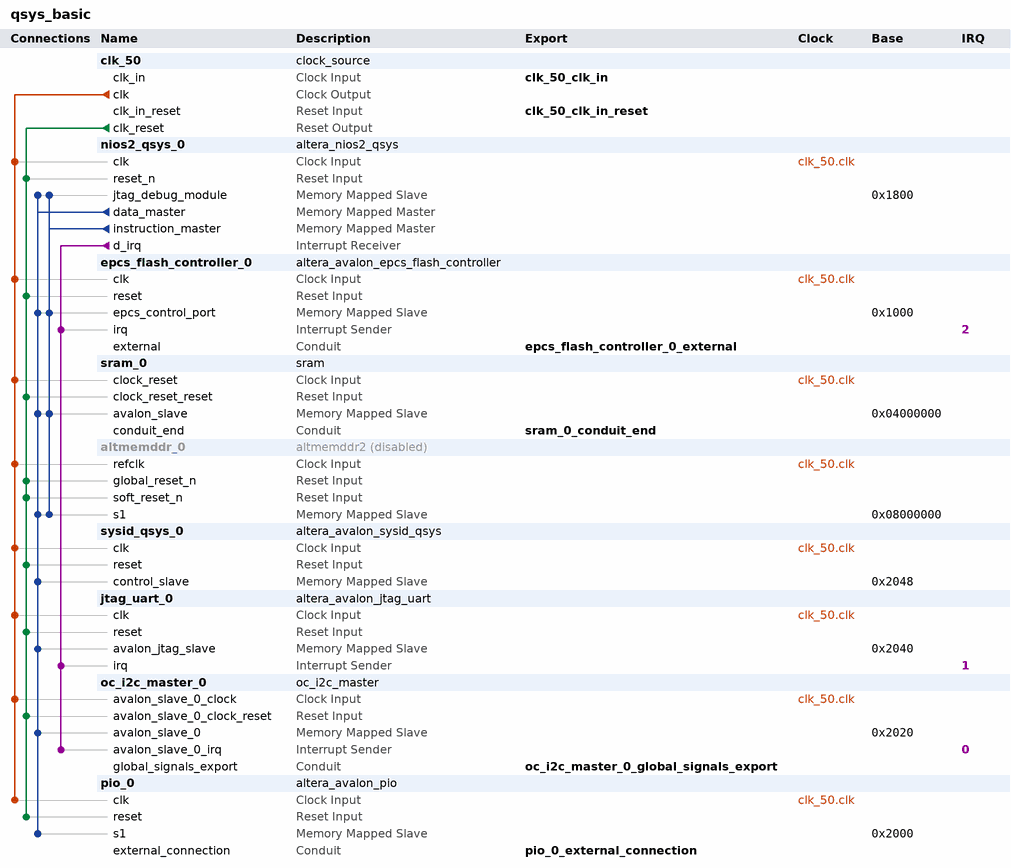
[diagram p0: system contents]
# Platform Designer (Qsys) system qsys_basic, Cyclone IV E EP4CE22F17C8
# Parameters at their usual value, and those the tool derives, are not listed.
package require -exact qsys 13.0
create_system qsys_basic
set_project_property DEVICE_FAMILY {Cyclone IV E}
set_project_property DEVICE EP4CE22F17C8

add_instance clk_50 clock_source 13.0
set_instance_parameter_value clk_50 clockFrequency 50000000

add_instance nios2_qsys_0 altera_nios2_qsys 13.0
set_instance_parameter_value nios2_qsys_0 resetSlave epcs_flash_controller_0.epcs_control_port
set_instance_parameter_value nios2_qsys_0 exceptionSlave sram_0.avalon_slave
set_instance_parameter_value nios2_qsys_0 breakSlave nios2_qsys_0.jtag_debug_module
set_instance_parameter_value nios2_qsys_0 impl Tiny
set_instance_parameter_value nios2_qsys_0 icache_size 512

add_instance epcs_flash_controller_0 altera_avalon_epcs_flash_controller 13.0.1

add_instance sram_0 sram 1.0
set_instance_parameter_value sram_0 DATA_BITS 16
set_instance_parameter_value sram_0 ADDR_BITS 18

add_instance altmemddr_0 altmemddr2 13.0
set_instance_property altmemddr_0 ENABLED false
set_instance_parameter_value altmemddr_0 pipeline_commands false
set_instance_parameter_value altmemddr_0 debug_en false
set_instance_parameter_value altmemddr_0 export_debug_port false
set_instance_parameter_value altmemddr_0 use_generated_memory_model true
set_instance_parameter_value altmemddr_0 dedicated_memory_clk_phase_label {Dedicated memory clock phase:}
set_instance_parameter_value altmemddr_0 mem_if_clk_mhz 150.0
set_instance_parameter_value altmemddr_0 quartus_project_exists false
set_instance_parameter_value altmemddr_0 local_if_drate Half
set_instance_parameter_value altmemddr_0 enable_v72_rsu false
set_instance_parameter_value altmemddr_0 local_if_clk_mhz_label 75.0
set_instance_parameter_value altmemddr_0 new_variant true
set_instance_parameter_value altmemddr_0 mem_if_memtype {DDR2 SDRAM}
set_instance_parameter_value altmemddr_0 pll_ref_clk_mhz 50.0
set_instance_parameter_value altmemddr_0 mem_if_clk_ps_label {(6667 ps)}
set_instance_parameter_value altmemddr_0 family {Cyclone IV E}
set_instance_parameter_value altmemddr_0 project_family {Cyclone IV E}
set_instance_parameter_value altmemddr_0 speed_grade 8
set_instance_parameter_value altmemddr_0 dedicated_memory_clk_phase 0
set_instance_parameter_value altmemddr_0 pll_ref_clk_ps_label {(20000 ps)}
set_instance_parameter_value altmemddr_0 avalon_burst_length 1
set_instance_parameter_value altmemddr_0 mem_if_clk_pair_count 1
set_instance_parameter_value altmemddr_0 mem_if_cs_per_dimm 1
set_instance_parameter_value altmemddr_0 pre_latency_label {Fix read latency at:}
set_instance_parameter_value altmemddr_0 dedicated_memory_clk_en false
set_instance_parameter_value altmemddr_0 mirror_addressing 0
set_instance_parameter_value altmemddr_0 mem_if_bankaddr_width 2
set_instance_parameter_value altmemddr_0 register_control_word_9 0000
set_instance_parameter_value altmemddr_0 mem_if_rowaddr_width 13
set_instance_parameter_value altmemddr_0 mem_dyn_deskew_en false
set_instance_parameter_value altmemddr_0 post_latency_label {cycles (0 cycles=minimum latency, non-deterministic)}
set_instance_parameter_value altmemddr_0 mem_if_dm_pins_en Yes
set_instance_parameter_value altmemddr_0 local_if_dwidth_label 64
set_instance_parameter_value altmemddr_0 register_control_word_7 0000
set_instance_parameter_value altmemddr_0 register_control_word_8 0000
set_instance_parameter_value altmemddr_0 mem_if_preset {Custom (Micron MT47H16M16BG-37E)}
set_instance_parameter_value altmemddr_0 mem_if_pchaddr_bit 10
set_instance_parameter_value altmemddr_0 WIDTH_RATIO 4
set_instance_parameter_value altmemddr_0 vendor Micron
set_instance_parameter_value altmemddr_0 register_control_word_3 0000
set_instance_parameter_value altmemddr_0 register_control_word_4 0000
set_instance_parameter_value altmemddr_0 chip_or_dimm {Discrete Device}
set_instance_parameter_value altmemddr_0 register_control_word_5 0000
set_instance_parameter_value altmemddr_0 register_control_word_6 0000
set_instance_parameter_value altmemddr_0 mem_fmax 267.0
set_instance_parameter_value altmemddr_0 register_control_word_0 0000
set_instance_parameter_value altmemddr_0 register_control_word_size 4
set_instance_parameter_value altmemddr_0 register_control_word_1 0000
set_instance_parameter_value altmemddr_0 register_control_word_2 0000
set_instance_parameter_value altmemddr_0 register_control_word_11 0000
set_instance_parameter_value altmemddr_0 register_control_word_10 0000
set_instance_parameter_value altmemddr_0 mem_if_cs_width 1
set_instance_parameter_value altmemddr_0 mem_if_preset_rlat 0
set_instance_parameter_value altmemddr_0 mem_if_cs_per_rank 1
set_instance_parameter_value altmemddr_0 fast_simulation_en FAST
set_instance_parameter_value altmemddr_0 register_control_word_15 0000
set_instance_parameter_value altmemddr_0 register_control_word_14 0000
set_instance_parameter_value altmemddr_0 mem_if_dwidth 16
set_instance_parameter_value altmemddr_0 mem_if_dq_per_dqs 8
set_instance_parameter_value altmemddr_0 mem_if_coladdr_width 10
set_instance_parameter_value altmemddr_0 register_control_word_13 0000
set_instance_parameter_value altmemddr_0 register_control_word_12 0000
set_instance_parameter_value altmemddr_0 mem_tiha_ps 500
set_instance_parameter_value altmemddr_0 mem_tdsh_ck 0.2
set_instance_parameter_value altmemddr_0 mem_if_trfc_ns 75.0
set_instance_parameter_value altmemddr_0 mem_tqh_ck 0.36
set_instance_parameter_value altmemddr_0 mem_tisa_ps 500
set_instance_parameter_value altmemddr_0 mem_tdss_ck 0.2
set_instance_parameter_value altmemddr_0 mem_trtp_ns 7.5
set_instance_parameter_value altmemddr_0 mem_if_tinit_us 200.0
set_instance_parameter_value altmemddr_0 mem_if_trcd_ns 15.0
set_instance_parameter_value altmemddr_0 mem_if_twtr_ck 2
set_instance_parameter_value altmemddr_0 mem_trrd_ns 10.0
set_instance_parameter_value altmemddr_0 mem_tdqss_ck 0.25
set_instance_parameter_value altmemddr_0 mem_tqhs_ps 400
set_instance_parameter_value altmemddr_0 mem_tdsa_ps 345
set_instance_parameter_value altmemddr_0 mem_tac_ps 500
set_instance_parameter_value altmemddr_0 mem_tdha_ps 285
set_instance_parameter_value altmemddr_0 mem_if_tras_ns 40.0
set_instance_parameter_value altmemddr_0 mem_if_twr_ns 15.0
set_instance_parameter_value altmemddr_0 mem_tdqsck_ps 450
set_instance_parameter_value altmemddr_0 mem_if_trp_ns 15.0
set_instance_parameter_value altmemddr_0 mem_tdqsq_ps 300
set_instance_parameter_value altmemddr_0 mem_if_tmrd_ns 7.5
set_instance_parameter_value altmemddr_0 mem_tfaw_ns 50.0
set_instance_parameter_value altmemddr_0 mem_if_trefi_us 7.8
set_instance_parameter_value altmemddr_0 mem_tcl_40_fmax 267.0
set_instance_parameter_value altmemddr_0 mem_odt Disabled
set_instance_parameter_value altmemddr_0 mp_WLH_percent 0.6
set_instance_parameter_value altmemddr_0 mem_drv_str Normal
set_instance_parameter_value altmemddr_0 mp_DH_percent 0.5
set_instance_parameter_value altmemddr_0 input_period 0
set_instance_parameter_value altmemddr_0 mp_QH_percent 0.5
set_instance_parameter_value altmemddr_0 mp_QHS_percent 0.5
set_instance_parameter_value altmemddr_0 mem_tcl_30_fmax 200.0
set_instance_parameter_value altmemddr_0 ac_clk_select 90
set_instance_parameter_value altmemddr_0 mp_DQSQ_percent 0.65
set_instance_parameter_value altmemddr_0 mp_DS_percent 0.6
set_instance_parameter_value altmemddr_0 pll_reconfig_ports_en false
set_instance_parameter_value altmemddr_0 mem_btype Sequential
set_instance_parameter_value altmemddr_0 mp_IS_percent 0.7
set_instance_parameter_value altmemddr_0 mem_tcl 4.0
set_instance_parameter_value altmemddr_0 mp_DQSS_percent 0.5
set_instance_parameter_value altmemddr_0 export_bank_info false
set_instance_parameter_value altmemddr_0 mp_DSS_percent 0.6
set_instance_parameter_value altmemddr_0 mem_dll_en Yes
set_instance_parameter_value altmemddr_0 ac_phase 90
set_instance_parameter_value altmemddr_0 mem_if_oct_en false
set_instance_parameter_value altmemddr_0 mem_tcl_60_fmax 267.0
set_instance_parameter_value altmemddr_0 mp_DSH_percent 0.6
set_instance_parameter_value altmemddr_0 mem_if_dqsn_en false
set_instance_parameter_value altmemddr_0 enable_mp_calibration true
set_instance_parameter_value altmemddr_0 mp_IH_percent 0.6
set_instance_parameter_value altmemddr_0 mem_tcl_15_fmax 533.0
set_instance_parameter_value altmemddr_0 dll_external false
set_instance_parameter_value altmemddr_0 mem_bl 8
set_instance_parameter_value altmemddr_0 mp_WLS_percent 0.7
set_instance_parameter_value altmemddr_0 mem_tcl_50_fmax 267.0
set_instance_parameter_value altmemddr_0 mp_DQSCK_percent 0.5
set_instance_parameter_value altmemddr_0 mem_tcl_25_fmax 533.0
set_instance_parameter_value altmemddr_0 mem_tcl_20_fmax 533.0
set_instance_parameter_value altmemddr_0 cfg_reorder_data true
set_instance_parameter_value altmemddr_0 ctl_ecc_en false
set_instance_parameter_value altmemddr_0 ctl_hrb_en false
set_instance_parameter_value altmemddr_0 ref_clk_source clk_50
set_instance_parameter_value altmemddr_0 cfg_data_reordering_type INTER_BANK
set_instance_parameter_value altmemddr_0 ctl_powerdn_en false
set_instance_parameter_value altmemddr_0 multicast_wr_en false
set_instance_parameter_value altmemddr_0 auto_powerdn_cycles 0
set_instance_parameter_value altmemddr_0 ctl_self_refresh_en false
set_instance_parameter_value altmemddr_0 cfg_starve_limit 10
set_instance_parameter_value altmemddr_0 ctl_latency 0
set_instance_parameter_value altmemddr_0 tool_context SOPC_BUILDER
set_instance_parameter_value altmemddr_0 mem_addr_mapping CHIP_ROW_BANK_COL
set_instance_parameter_value altmemddr_0 burst_merge_en false
set_instance_parameter_value altmemddr_0 user_refresh_en false
set_instance_parameter_value altmemddr_0 qsys_mode true
set_instance_parameter_value altmemddr_0 clk_source_sharing_en false
set_instance_parameter_value altmemddr_0 ctl_lookahead_depth 4
set_instance_parameter_value altmemddr_0 ctl_autopch_en false
set_instance_parameter_value altmemddr_0 ctl_dynamic_bank_allocation false
set_instance_parameter_value altmemddr_0 ctl_dynamic_bank_num 4
set_instance_parameter_value altmemddr_0 local_if_type_avalon true
set_instance_parameter_value altmemddr_0 csr_en false
set_instance_parameter_value altmemddr_0 ctl_auto_correct_en false
set_instance_parameter_value altmemddr_0 auto_powerdn_en false
set_instance_parameter_value altmemddr_0 phy_if_type_afi true
set_instance_parameter_value altmemddr_0 controller_type ngv110_ctl
set_instance_parameter_value altmemddr_0 max_local_size 4
set_instance_parameter_value altmemddr_0 mem_srtr Normal
set_instance_parameter_value altmemddr_0 mem_mpr_loc {Predefined Pattern}
set_instance_parameter_value altmemddr_0 dss_tinit_rst_us 200.0
set_instance_parameter_value altmemddr_0 mem_tcl_90_fmax 400.0
set_instance_parameter_value altmemddr_0 mem_rtt_wr {Dynamic ODT off}
set_instance_parameter_value altmemddr_0 mem_tcl_100_fmax 400.0
set_instance_parameter_value altmemddr_0 mem_pasr {Full Array}
set_instance_parameter_value altmemddr_0 mem_asrm {Manual SR Reference (SRT)}
set_instance_parameter_value altmemddr_0 mem_mpr_oper {Predefined Pattern}
set_instance_parameter_value altmemddr_0 mem_tcl_80_fmax 400.0
set_instance_parameter_value altmemddr_0 mem_drv_impedance RZQ/7
set_instance_parameter_value altmemddr_0 mem_rtt_nom {ODT Disabled}
set_instance_parameter_value altmemddr_0 mem_tcl_70_fmax 400.0
set_instance_parameter_value altmemddr_0 mem_wtcl 5.0
set_instance_parameter_value altmemddr_0 mem_dll_pch {Fast Exit}
set_instance_parameter_value altmemddr_0 mem_atcl Disabled
set_instance_parameter_value altmemddr_0 board_settings_valid true
set_instance_parameter_value altmemddr_0 t_IH 0.5
set_instance_parameter_value altmemddr_0 board_intra_DQS_group_skew 0.02
set_instance_parameter_value altmemddr_0 isi_DQS 0.0
set_instance_parameter_value altmemddr_0 addr_cmd_slew_rate 1.0
set_instance_parameter_value altmemddr_0 board_tpd_inter_DIMM 0.05
set_instance_parameter_value altmemddr_0 board_addresscmd_CK_skew 0.0
set_instance_parameter_value altmemddr_0 t_DS_calculated 0.350
set_instance_parameter_value altmemddr_0 isi_addresscmd_hold 0.0
set_instance_parameter_value altmemddr_0 t_IS 0.5
set_instance_parameter_value altmemddr_0 restore_default_toggle false
set_instance_parameter_value altmemddr_0 dqs_dqsn_slew_rate 2.0
set_instance_parameter_value altmemddr_0 dq_slew_rate 1.0
set_instance_parameter_value altmemddr_0 board_inter_DQS_group_skew 0.02
set_instance_parameter_value altmemddr_0 isi_addresscmd_setup 0.0
set_instance_parameter_value altmemddr_0 board_minCK_DQS_skew -0.01
set_instance_parameter_value altmemddr_0 t_IS_calculated 0.500
set_instance_parameter_value altmemddr_0 num_slots_or_devices 1
set_instance_parameter_value altmemddr_0 board_maxCK_DQS_skew 0.01
set_instance_parameter_value altmemddr_0 board_skew_ps 20
set_instance_parameter_value altmemddr_0 t_DH 0.35
set_instance_parameter_value altmemddr_0 ck_ckn_slew_rate 2.0
set_instance_parameter_value altmemddr_0 isi_DQ 0.0
set_instance_parameter_value altmemddr_0 t_IH_calculated 0.500
set_instance_parameter_value altmemddr_0 t_DH_calculated 0.350
set_instance_parameter_value altmemddr_0 t_DS 0.35

add_instance sysid_qsys_0 altera_avalon_sysid_qsys 13.0
set_instance_parameter_value sysid_qsys_0 id 305441741

add_instance jtag_uart_0 altera_avalon_jtag_uart 13.0.1
set_instance_parameter_value jtag_uart_0 simInteractiveOptions INTERACTIVE_ASCII_OUTPUT

add_instance oc_i2c_master_0 oc_i2c_master 1.2

add_instance pio_0 altera_avalon_pio 13.0.1
set_instance_parameter_value pio_0 bitModifyingOutReg true
set_instance_parameter_value pio_0 direction Bidir
set_instance_parameter_value pio_0 width 8

# connections
add_connection clk_50.clk altmemddr_0.refclk clock
add_connection clk_50.clk epcs_flash_controller_0.clk clock
add_connection clk_50.clk jtag_uart_0.clk clock
add_connection clk_50.clk nios2_qsys_0.clk clock
add_connection clk_50.clk oc_i2c_master_0.avalon_slave_0_clock clock
add_connection clk_50.clk pio_0.clk clock
add_connection clk_50.clk sram_0.clock_reset clock
add_connection clk_50.clk sysid_qsys_0.clk clock
add_connection clk_50.clk_reset altmemddr_0.global_reset_n reset
add_connection clk_50.clk_reset altmemddr_0.soft_reset_n reset
add_connection clk_50.clk_reset epcs_flash_controller_0.reset reset
add_connection clk_50.clk_reset jtag_uart_0.reset reset
add_connection clk_50.clk_reset nios2_qsys_0.reset_n reset
add_connection clk_50.clk_reset oc_i2c_master_0.avalon_slave_0_clock_reset reset
add_connection clk_50.clk_reset pio_0.reset reset
add_connection clk_50.clk_reset sram_0.clock_reset_reset reset
add_connection clk_50.clk_reset sysid_qsys_0.reset reset
add_connection nios2_qsys_0.data_master altmemddr_0.s1 avalon
set_connection_parameter_value nios2_qsys_0.data_master/altmemddr_0.s1 baseAddress 0x08000000
add_connection nios2_qsys_0.data_master epcs_flash_controller_0.epcs_control_port avalon
set_connection_parameter_value nios2_qsys_0.data_master/epcs_flash_controller_0.epcs_control_port baseAddress 0x1000
add_connection nios2_qsys_0.data_master jtag_uart_0.avalon_jtag_slave avalon
set_connection_parameter_value nios2_qsys_0.data_master/jtag_uart_0.avalon_jtag_slave baseAddress 0x2040
add_connection nios2_qsys_0.data_master nios2_qsys_0.jtag_debug_module avalon
set_connection_parameter_value nios2_qsys_0.data_master/nios2_qsys_0.jtag_debug_module baseAddress 0x1800
add_connection nios2_qsys_0.data_master oc_i2c_master_0.avalon_slave_0 avalon
set_connection_parameter_value nios2_qsys_0.data_master/oc_i2c_master_0.avalon_slave_0 baseAddress 0x2020
add_connection nios2_qsys_0.data_master pio_0.s1 avalon
set_connection_parameter_value nios2_qsys_0.data_master/pio_0.s1 baseAddress 0x2000
add_connection nios2_qsys_0.data_master sram_0.avalon_slave avalon
set_connection_parameter_value nios2_qsys_0.data_master/sram_0.avalon_slave baseAddress 0x04000000
add_connection nios2_qsys_0.data_master sysid_qsys_0.control_slave avalon
set_connection_parameter_value nios2_qsys_0.data_master/sysid_qsys_0.control_slave baseAddress 0x2048
add_connection nios2_qsys_0.instruction_master altmemddr_0.s1 avalon
set_connection_parameter_value nios2_qsys_0.instruction_master/altmemddr_0.s1 baseAddress 0x08000000
add_connection nios2_qsys_0.instruction_master epcs_flash_controller_0.epcs_control_port avalon
set_connection_parameter_value nios2_qsys_0.instruction_master/epcs_flash_controller_0.epcs_control_port baseAddress 0x1000
add_connection nios2_qsys_0.instruction_master nios2_qsys_0.jtag_debug_module avalon
set_connection_parameter_value nios2_qsys_0.instruction_master/nios2_qsys_0.jtag_debug_module baseAddress 0x1800
add_connection nios2_qsys_0.instruction_master sram_0.avalon_slave avalon
set_connection_parameter_value nios2_qsys_0.instruction_master/sram_0.avalon_slave baseAddress 0x04000000
add_connection nios2_qsys_0.d_irq epcs_flash_controller_0.irq interrupt
set_connection_parameter_value nios2_qsys_0.d_irq/epcs_flash_controller_0.irq irqNumber 2
add_connection nios2_qsys_0.d_irq jtag_uart_0.irq interrupt
set_connection_parameter_value nios2_qsys_0.d_irq/jtag_uart_0.irq irqNumber 1
add_connection nios2_qsys_0.d_irq oc_i2c_master_0.avalon_slave_0_irq interrupt
set_connection_parameter_value nios2_qsys_0.d_irq/oc_i2c_master_0.avalon_slave_0_irq irqNumber 0

# exported interfaces
add_interface oc_i2c_master_0_global_signals_export conduit end
set_interface_property oc_i2c_master_0_global_signals_export EXPORT_OF oc_i2c_master_0.global_signals_export
add_interface clk_50_clk_in_reset reset sink
set_interface_property clk_50_clk_in_reset EXPORT_OF clk_50.clk_in_reset
add_interface clk_50_clk_in clock sink
set_interface_property clk_50_clk_in EXPORT_OF clk_50.clk_in
add_interface epcs_flash_controller_0_external conduit end
set_interface_property epcs_flash_controller_0_external EXPORT_OF epcs_flash_controller_0.external
add_interface pio_0_external_connection conduit end
set_interface_property pio_0_external_connection EXPORT_OF pio_0.external_connection
add_interface sram_0_conduit_end conduit end
set_interface_property sram_0_conduit_end EXPORT_OF sram_0.conduit_end

set_interconnect_requirement {$system} qsys_mm.clockCrossingAdapter AUTO
set_interconnect_requirement {$system} qsys_mm.maxAdditionalLatency 1

save_system qsys_basic.qsys
